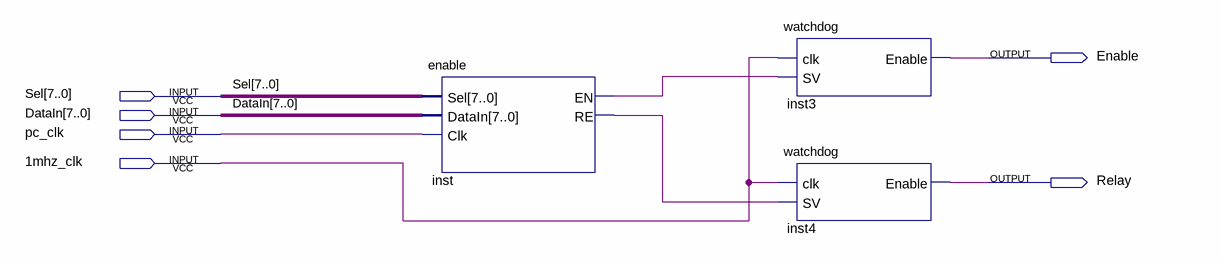
[diagram p0: schematic sheet]
// Quartus schematic enable test.bdf as structural Verilog: 3 symbols, 6 pins
module \enable_test  (
  input  [7:0] Sel,
  input  [7:0] DataIn,
  input  pc_clk,
  input  \1mhz_clk ,
  output Enable,
  output Relay
);

  wire inst_en, inst_re;

  enable inst (.Sel(Sel), .DataIn(DataIn), .Clk(pc_clk), .EN(inst_en), .RE(inst_re));
  watchdog inst3 (.clk(\1mhz_clk ), .SV(inst_en), .Enable(Enable));
  watchdog inst4 (.clk(\1mhz_clk ), .SV(inst_re), .Enable(Relay));
endmodule
